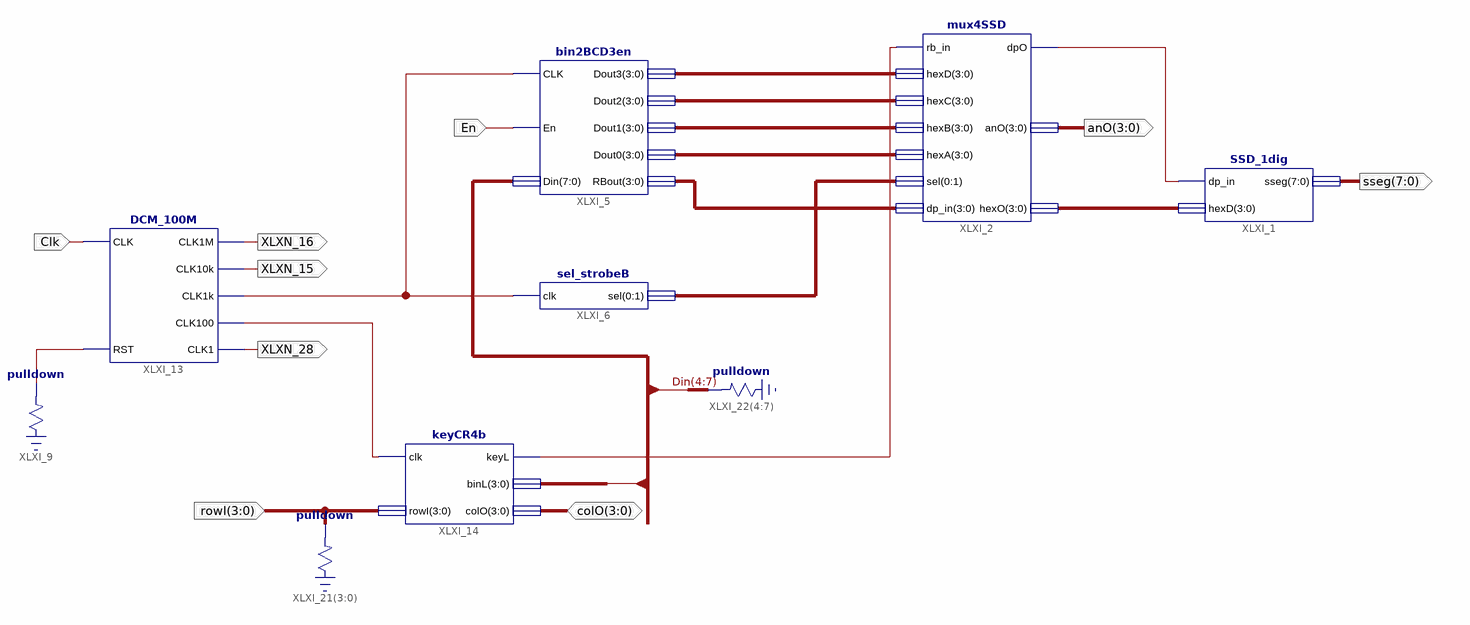
[diagram p0: schematic sheet 1]
// Xilinx ISE schematic Lab6Exp4.sch (spartan3e) as structural Verilog: 9 symbols, 9 ports
module Lab6Exp4 (
  input  En,
  input  Clk,
  input  [3:0] rowI,
  inout  [3:0] colO,
  output [3:0] anO,
  output [7:0] sseg,
  output XLXN_15,
  output XLXN_16,
  output XLXN_28
);

  wire XLXN_4, XLXN_14, XLXN_18, XLXN_21, XLXN_33;
  wire [1:0] XLXN_12;
  wire [3:0] XLXN_1, XLXN_5, XLXN_6, XLXN_9, XLXN_11, XLXN_26;
  wire [7:0] Din;

  SSD_1dig XLXI_1 (.dp_in(XLXN_4), .hexD(XLXN_1), .sseg(sseg));
  mux4SSD XLXI_2 (
    .rb_in(XLXN_33), .hexD(XLXN_11), .hexC(XLXN_9), .hexB(XLXN_6), .hexA(XLXN_5),
    .sel({XLXN_12[0], XLXN_12[1]}), .dp_in(XLXN_26), .dpO(XLXN_4), .anO(anO), .hexO(XLXN_1));
  \pulldown  XLXI_9 (.O(XLXN_18));
  bin2BCD3en XLXI_5 (
    .CLK(XLXN_21), .En(En), .Din(Din), .Dout3(XLXN_11), .Dout2(XLXN_9), .Dout1(XLXN_6), .Dout0(XLXN_5),
    .RBout(XLXN_26));
  sel_strobeB XLXI_6 (.clk(XLXN_21), .sel({XLXN_12[0], XLXN_12[1]}));
  DCM_100M XLXI_13 (
    .CLK(Clk), .RST(XLXN_18), .CLK1M(XLXN_16), .CLK10k(XLXN_15), .CLK1k(XLXN_21), .CLK100(XLXN_14),
    .CLK1(XLXN_28));
  keyCR4b XLXI_14 (.clk(XLXN_14), .rowI(rowI), .keyL(XLXN_33), .binL(Din[3:0]), .colO(colO));
  \pulldown  XLXI_21[3:0] (.O(rowI));
  \pulldown  XLXI_22[4:7] (.O({Din[4], Din[5], Din[6], Din[7]}));
endmodule
